# Altium project Gimbal_Rev2.PrjPcb (part 2 of 2)

## Sheet CAN.SchDoc: Gimbal - CAN
size Letter; Author: Jing Hao Yao; DrawnBy: Aidan Gratton & Jing Hao Yao; Organization: UW Robotics; Address1: 200 University Avenue; Address2: Waterloo; Address3: Ontario; Address4: Canada N2L 3G6; SheetNumber: 5; SheetTotal: 7
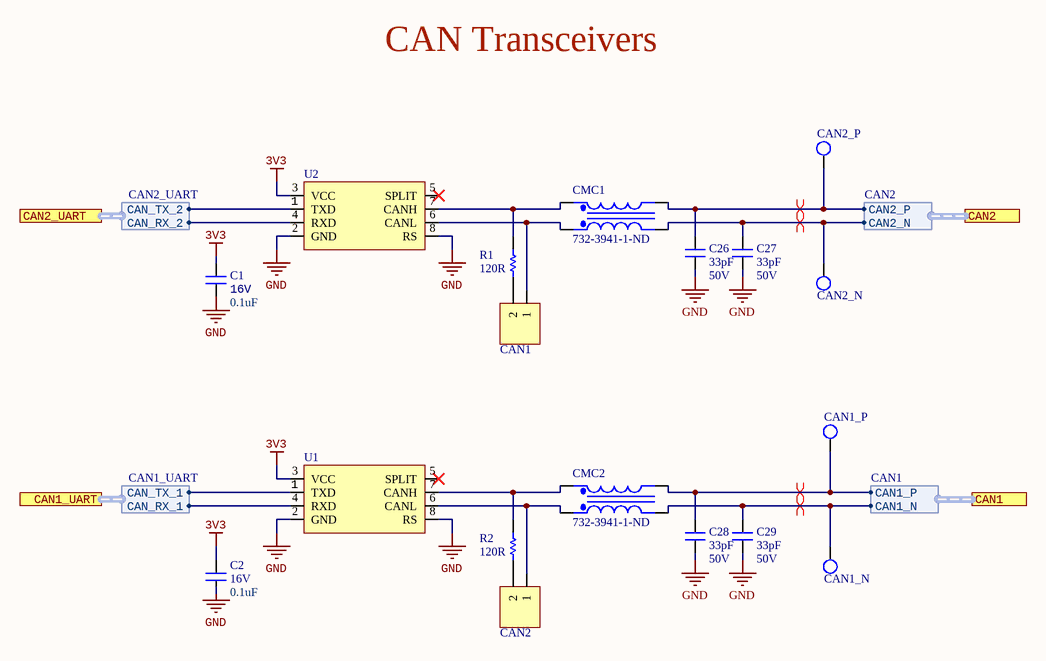
[diagram p5: CAN.SchDoc]

### Parts
C1  value 0.1uF  Voltage Rating: 16V  [CAPC0603(1608)55_N]  (hidden comment: CAP_0.1uF_16V_0603)
C2  value 0.1uF  Voltage Rating: 16V  [CAPC0603(1608)55_N]  (hidden comment: CAP_0.1uF_16V_0603)
C26  Voltage: 50V  Capacitance: 33pF  [CAPC0603(1608)55_N]  (hidden comment: CAP_33pF_50V_0603)
C27  Voltage: 50V  Capacitance: 33pF  [CAPC0603(1608)55_N]  (hidden comment: CAP_33pF_50V_0603)
C28  Voltage Rating: 50V  Capacitance: 33pF  [CAPC0603(1608)55_N]  (hidden comment: CAP_33pF_50V_0603)
C29  Voltage Rating: 50V  Capacitance: 33pF  [CAPC0603(1608)55_N]  (hidden comment: CAP_33pF_50V_0603)
CAN1  JUMPER_2  [HDR1X2]  (value not drawn)
CAN1_N  TESTPOINT_LOOP  [TESTPOINT_LOOP]  (value not drawn)
CAN1_P  TESTPOINT_LOOP  [TESTPOINT_LOOP]  (value not drawn)
CAN2  JUMPER_2  [HDR1X2]  (value not drawn)
CAN2_N  TESTPOINT_LOOP  [TESTPOINT_LOOP]  (value not drawn)
CAN2_P  TESTPOINT_LOOP  [TESTPOINT_LOOP]  (value not drawn)
CMC1  Supplier Part Number 1: 732-3941-1-ND  [744212510]  (hidden comment: CMC_51uH)
CMC2  Supplier Part Number 1: 732-3941-1-ND  [744212510]  (hidden comment: CMC_51uH)
R1  value 120R  [RESC0603(1608)_N]  (hidden comment: RES_120R_0603)
R2  value 120R  [RESC0603(1608)_N]  (hidden comment: RES_120R_0603)
U1  IC TXRX CAN  [LT-S8_N]  (value not drawn)
U2  IC TXRX CAN  [LT-S8_N]  (value not drawn)

### Ports
CAN1 (harness CAN1), CAN1_UART (harness CAN1_UART), CAN2 (harness CAN2), CAN2_UART (harness CAN2_UART)

### Harnesses
CAN1: CAN1_P, CAN1_N
CAN2: CAN2_P, CAN2_N
CAN2_UART: CAN_RX_2, CAN_TX_2
CAN1_UART: CAN_RX_1, CAN_TX_1

### Nets
3V3: C1.2 C2.2 U1.3(VCC) U2.3(VCC)
GND: C1.1 C2.1 C26.1 C27.1 C28.1 C29.1 U1.2(GND) U1.8(RS) U2.2(GND) U2.8(RS)
CAN1_A_N: C29.2 CAN1_N.1 CMC2.5(Pri-) ; port CAN1.CAN1_N
CAN1_A_P: C28.2 CAN1_P.1 CMC2.4(Sec-) ; port CAN1.CAN1_P
CAN2_A_N: C27.2 CAN2_N.1 CMC1.5(Pri-) ; port CAN2.CAN2_N
CAN2_A_P: C26.2 CAN2_P.1 CMC1.4(Sec-) ; port CAN2.CAN2_P
NetCAN1_1: CAN1.1 CMC1.1(Pri+) U2.6(CANL)
NetCAN1_2: CAN1.2 R1.2
NetCAN2_1: CAN2.1 CMC2.1(Pri+) U1.6(CANL)
NetCAN2_2: CAN2.2 R2.2
NetCMC1_3: CMC1.3(Sec+) R1.1 U2.7(CANH)
NetCMC2_3: CMC2.3(Sec+) R2.1 U1.7(CANH)
NetU1_1: U1.1(TXD) ; port CAN1_UART.CAN_TX_1
NetU1_4: U1.4(RXD) ; port CAN1_UART.CAN_RX_1
NetU2_1: U2.1(TXD) ; port CAN2_UART.CAN_TX_2
NetU2_4: U2.4(RXD) ; port CAN2_UART.CAN_RX_2

Not connected (* = marked no-connect by the designer): U1 5(SPLIT)*; U2 5(SPLIT)*

### Layout directives
differential pair: CAN1_A_N, CAN1_A_P, CAN2_A_N, CAN2_A_P

### Notes on the sheet
- CAN Transceivers
- Title
- Size:
- Date:
- Letter
- Drawn By:
- Sheet
- of
- File:

### Library data of the parts
C1 C2 = CAP_0.1uF_16V_0603: CAP CER 0.1UF 16V X7R 0603; MPN: CC0603KRX7R7BB104; Manufacturer: Yageo; Dimensions: 0.063" L x 0.031" W (1.60mm x 0.80mm); Package: 0603 (1608 Metric); Temperature Coefficient: X7R; Supplier Part Number 1: 311-1088-1-ND; Supplier 1: Digi-Key
C26-C29 = CAP_33pF_50V_0603: CAP CER 33PF 50V C0G/NP0; Manufacturer 1: Yageo; Manufacturer Part Number 1: CC0603JRNPO9BN330; Dielectric Material: Ceramic; Temperature Coefficient: 30ppm/°C; Tolerance: 5%; Dielectric: C0G; Insulation Resistance: 100GR; Supplier 1: Digi-Key; Stock 1: 177901; Pricing 1: 1=0.10000, 10=0.04900, 100=0.02190, 500=0.01566, 1000=0.01231 (USD); RoHS: Yes; Mount: Surface Mount; Case/Package: 0603; Number of Pins: 2; Case Code (Metric): 1608; Case Code (Imperial): 0603; Min Operating Temperature: -55°C; Max Operating Temperature: 125°C; Termination: SMD/SMT; Composition: Ceramic; Packaging: Tape and Reel; Package Quantity: 1; Voltage Rating (DC): 50V; Length: 1.6mm; Height: 0.8mm; Thickness: 0.035inch; Depth: 0.8mm; Width: 0.031inch; Radiation Hardening: No; Lead Free: Lead Free; REACH SVHC: No SVHC; ComponentLink1URL: https://datasheet.ciiva.com/11786/0900766b8079c870-11786082.pdf?src-supplier=RSComponents; ComponentLink1Description: https://datasheet.ciiva.com/11786/0900766b8079c870-11786082.pdf?src-supplier=RSComponents; ComponentLink2URL: https://datasheet.ciiva.com/26862/getdatasheetpartid-403532-26862767.pdf?src-supplier=Verical; ComponentLink2Description: https://datasheet.ciiva.com/26862/getdatasheetpartid-403532-26862767.pdf?src-supplier=Verical; ComponentLink3URL: https://datasheet.ciiva.com/144/mlccorderingcode-144643.pdf?src-supplier=Digi-Key; ComponentLink3Description: https://datasheet.ciiva.com/144/mlccorderingcode-144643.pdf?src-supplier=Digi-Key; ComponentLink4URL: https://datasheet.ciiva.com/144/mlccorderingcode-144645.pdf?src-supplier=Digi-Key; ComponentLink4Description: https://datasheet.ciiva.com/144/mlccorderingcode-144645.pdf?src-supplier=Digi-Key; ComponentLink5URL: https://datasheet.ciiva.com/8033/1372269-8033734.pdf?src-supplier=Element14; ComponentLink5Description: https://datasheet.ciiva.com/8033/1372269-8033734.pdf?src-supplier=Element14; ComponentLink6URL: https://datasheet.ciiva.com/8033/1443161-8033735.pdf?src-supplier=Element14; ComponentLink6Description: https://datasheet.ciiva.com/8033/1443161-8033735.pdf?src-supplier=Element14; ComponentLink7URL: https://datasheet.ciiva.com/11464/upy-gp-np0-16v-to-50v-8-11464730.pdf?src-supplier=Avnet; ComponentLink7Description: https://datasheet.ciiva.com/11464/upy-gp-np0-16v-to-50v-8-11464730.pdf?src-supplier=Avnet; ComponentLink8URL: https://datasheet.ciiva.com/46430/1835847-46430155.pdf?src-supplier=Element14; ComponentLink8Description: https://datasheet.ciiva.com/46430/1835847-46430155.pdf?src-supplier=Element14; ComponentLink9URL: https://datasheet.ciiva.com/144/mlccorderingcode-144644.pdf?src-supplier=Digi-Key; ComponentLink9Description: https://datasheet.ciiva.com/144/mlccorderingcode-144644.pdf?src-supplier=Digi-Key; ComponentLink10URL: https://datasheet.ciiva.com/5426/upy-gp-np0-16v-to-50v-8-5426614.pdf?src-supplier=Mouser; ComponentLink10Description: https://datasheet.ciiva.com/5426/upy-gp-np0-16v-to-50v-8-5426614.pdf?src-supplier=Mouser; ComponentLink11URL: https://datasheet.ciiva.com/7978/1443161-7978142.pdf?src-supplier=Element14; ComponentLink11Description: https://datasheet.ciiva.com/7978/1443161-7978142.pdf?src-supplier=Element14; Supplier Part Number 1: 311-1064-1-ND
  C26 C27: Voltage Rating: 50V
  C28 C29: Voltage: 50V
CAN1 CAN2 = JUMPER_2: HEADER 2X1; Supplier 1: Digi-Key; Supplier Part Number 1: A26542-ND
CAN1_N CAN1_P CAN2_N CAN2_P = TESTPOINT_LOOP: Loop testpoint through-hole pad; Manufacturer: Keystone Electronics; Manufacturer Part Number 1: 5002; Supplier Part Number 1: 36-5002-ND; Supplier 1: Digi-Key
CMC1 CMC2 = CMC_51uH: CMC 51uH 300MA 2LN SMD; Manufacturer 1: Wurth Electronics; Core Material: Ferrite; DC Resistance (DCR): 160mR; Test Frequency: 100kHz; Inductance Tolerance: 50%; Voltage Rating (DC): 80V; Number of Lines: 2; Impedance: 300R; Supplier 1: Digi-Key; Manufacturer Part Number 1: 744212510; Stock 1: 1070; Pricing 1: 1=4.22000, 10=4.16600, 50=3.76300, 100=3.62900, 500=3.36000 (USD); RoHS: Yes; Mount: Surface Mount; Case/Package: SMD/SMT; Number of Pins: 4; Min Operating Temperature: -40°C; Max Operating Temperature: 105°C; Current: 300mA; Max DC Current: 300mA; Termination: SMD/SMT; Current Rating: 300mA; Inductance: 51uH; Tolerance: 50%; Package Quantity: 1000; Packaging: Tape and Reel; Length: 6.5mm; Height: 1.65mm; Depth: 3.6mm; Width: 0.142inch; REACH SVHC: No SVHC; Lead Free: Lead Free; ComponentLink1URL: https://datasheet.ciiva.com/11800/0900766b8059564e-11800467.pdf?src-supplier=RSComponents; ComponentLink1Description: https://datasheet.ciiva.com/11800/0900766b8059564e-11800467.pdf?src-supplier=RSComponents; ComponentLink2URL: https://datasheet.ciiva.com/1130/744212510-1130407.pdf?src-supplier=Newark; ComponentLink2Description: https://datasheet.ciiva.com/1130/744212510-1130407.pdf?src-supplier=Newark; ComponentLink3URL: https://datasheet.ciiva.com/6048/1735560-6048484.pdf?src-supplier=Farnell; ComponentLink3Description: https://datasheet.ciiva.com/6048/1735560-6048484.pdf?src-supplier=Farnell; ComponentLink4URL: https://datasheet.ciiva.com/4952/744212510-77598-4952687.pdf?src-supplier=Mouser; ComponentLink4Description: https://datasheet.ciiva.com/4952/744212510-77598-4952687.pdf?src-supplier=Mouser; ComponentLink5URL: https://datasheet.ciiva.com/6216/744212510-6216346.pdf?src-supplier=Digi-Key; ComponentLink5Description: https://datasheet.ciiva.com/6216/744212510-6216346.pdf?src-supplier=Digi-Key; ComponentLink6URL: https://datasheet.ciiva.com/22705/1735560-22705131.pdf?src-supplier=Element14; ComponentLink6Description: https://datasheet.ciiva.com/22705/1735560-22705131.pdf?src-supplier=Element14; ComponentLink7URL: https://datasheet.ciiva.com/6216/744212510-6216348.pdf?src-supplier=Digi-Key; ComponentLink7Description: https://datasheet.ciiva.com/6216/744212510-6216348.pdf?src-supplier=Digi-Key; ComponentLink8URL: https://datasheet.ciiva.com/7764/1735560-7764951.pdf?src-supplier=Element14; ComponentLink8Description: https://datasheet.ciiva.com/7764/1735560-7764951.pdf?src-supplier=Element14
R1 R2 = RES_120R_0603: RES SMD 120 OHM 5% 1/10W 0603; Manufacturer: Yageo; MPN: RC0603JR-07120RL; Package: 0603 (1608 Metric); Dimensions: 0.063" L x 0.031" W (1.60mm x 0.80mm); Tolerance: 5%; Supplier Part Number 1: 311-120GRCT-ND; Supplier 1: Digi-Key
U1 U2 = LTC2875: IC TXRX CAN 4MBPS 8SO; Manufacturer 1: Linear Technologies; Manufacturer Part Number 1: LTC2875IS8#PBF; Package: 8-SOIC (0.154", 3.90mm Width); ComponentLink1Description: Datasheet; ComponentLink1URL: https://www.analog.com/media/en/technical-documentation/data-sheets/2875f.pdf; Supplier Part Number 1: LTC2875IS8#PBF-ND; Supplier 1: Digi-Key; Mount: Surface Mount

## Nets that join several sheets
3V3: Connectors (J1.1 R7.2), MCU (18 pins), POWER (+3V3.1 C16.2 R4.2 U8.2), Sensors (6 pins), CAN (C1.2 C2.2 U1.3 U2.3)
5V: Connectors (7 pins), POWER (+5V0.1 C15.2 F1.2 U8.3), Sensors (6 pins)
GND: Connectors (23 pins), MCU (25 pins), POWER (8 pins), Sensors (12 pins), CAN (10 pins)
CAN1_A_N: Connectors (D8.1 D10.1 J6.2 J7.2), CAN (C29.2 CAN1_N.1 CMC2.5)
CAN1_A_P: Connectors (D8.2 D10.2 J6.1 J7.1), CAN (C28.2 CAN1_P.1 CMC2.4)
CAN2_A_N: Connectors (D9.1 D11.1 J6.5 J7.5), CAN (C27.2 CAN2_N.1 CMC1.5)
CAN2_A_P: Connectors (D9.2 D11.2 J6.4 J7.4), CAN (C26.2 CAN2_P.1 CMC1.4)
NetCR_SERVO_1: Connectors (CR_SERVO.1 J3.5), MCU (U7.35)
NetECHO1_1: MCU (U7.59), Sensors (ECHO1.1 R13.1 R14.2)
NetECHO2_1: MCU (U7.62), Sensors (ECHO2.1 R15.1 R16.1)
NetENC1_1: MCU (U7.17), Sensors (ENC1.1 R21.1 R22.1)
NetJ1_2: Connectors (J1.2), MCU (TX1.1 U7.51)
NetJ1_3: Connectors (J1.3), MCU (RX1.1 U7.52)
NetJ1_6: Connectors (J1.6), MCU (U7.46)
NetJ1_7: Connectors (J1.7), MCU (U7.49)
NetJ1_8: Connectors (J1.8), MCU (R17.1 RST.2)
NetJ3_1: Connectors (J3.1 STD_SERVO.1), MCU (U7.36)
NetJ4_3: Connectors (J4.3), Sensors (R13.2)
NetJ4_5: Connectors (J4.5 J4.11 R5.1), Sensors (6 pins)
NetJ4_9: Connectors (J4.9), Sensors (R15.2)
NetJ4_10: Connectors (J4.10 R7.1), MCU (U7.2)
NetJ4_15: Connectors (J4.15), Sensors (U4.13)
NetJ4_17: Connectors (J4.17), Sensors (U4.12)
NetJ4_19: Connectors (J4.19), Sensors (U4.11)
NetJ4_23: Connectors (J4.23), Sensors (R22.2)
NetSPI_MISO_1: MCU (U7.22), Sensors (SPI_MISO.1 U4.4)
NetSPI_MOSI_1: MCU (U7.23), Sensors (SPI_MOSI.1 U4.2)
NetSPI_SCK_1: MCU (U7.21), Sensors (SPI_SCK.1 U4.3)
NetU1_1: MCU (U7.45), CAN (U1.1)
NetU1_4: MCU (U7.44), CAN (U1.4)
NetU2_1: MCU (U7.34), CAN (U2.1)
NetU2_4: MCU (U7.33), CAN (U2.4)
NetU3_2: MCU (U7.58), Sensors (U3.2)
NetU3_3: MCU (U7.61), Sensors (U3.3)
NetU3_4: MCU (U7.16), Sensors (U3.4)